# Altium project Cubesat OBC.PrjPcb (part 2 of 2)

## Sheet PC104_52-52.SchDoc
size 420 x 297 mm; SheetNumber: 8; SheetTotal: 13
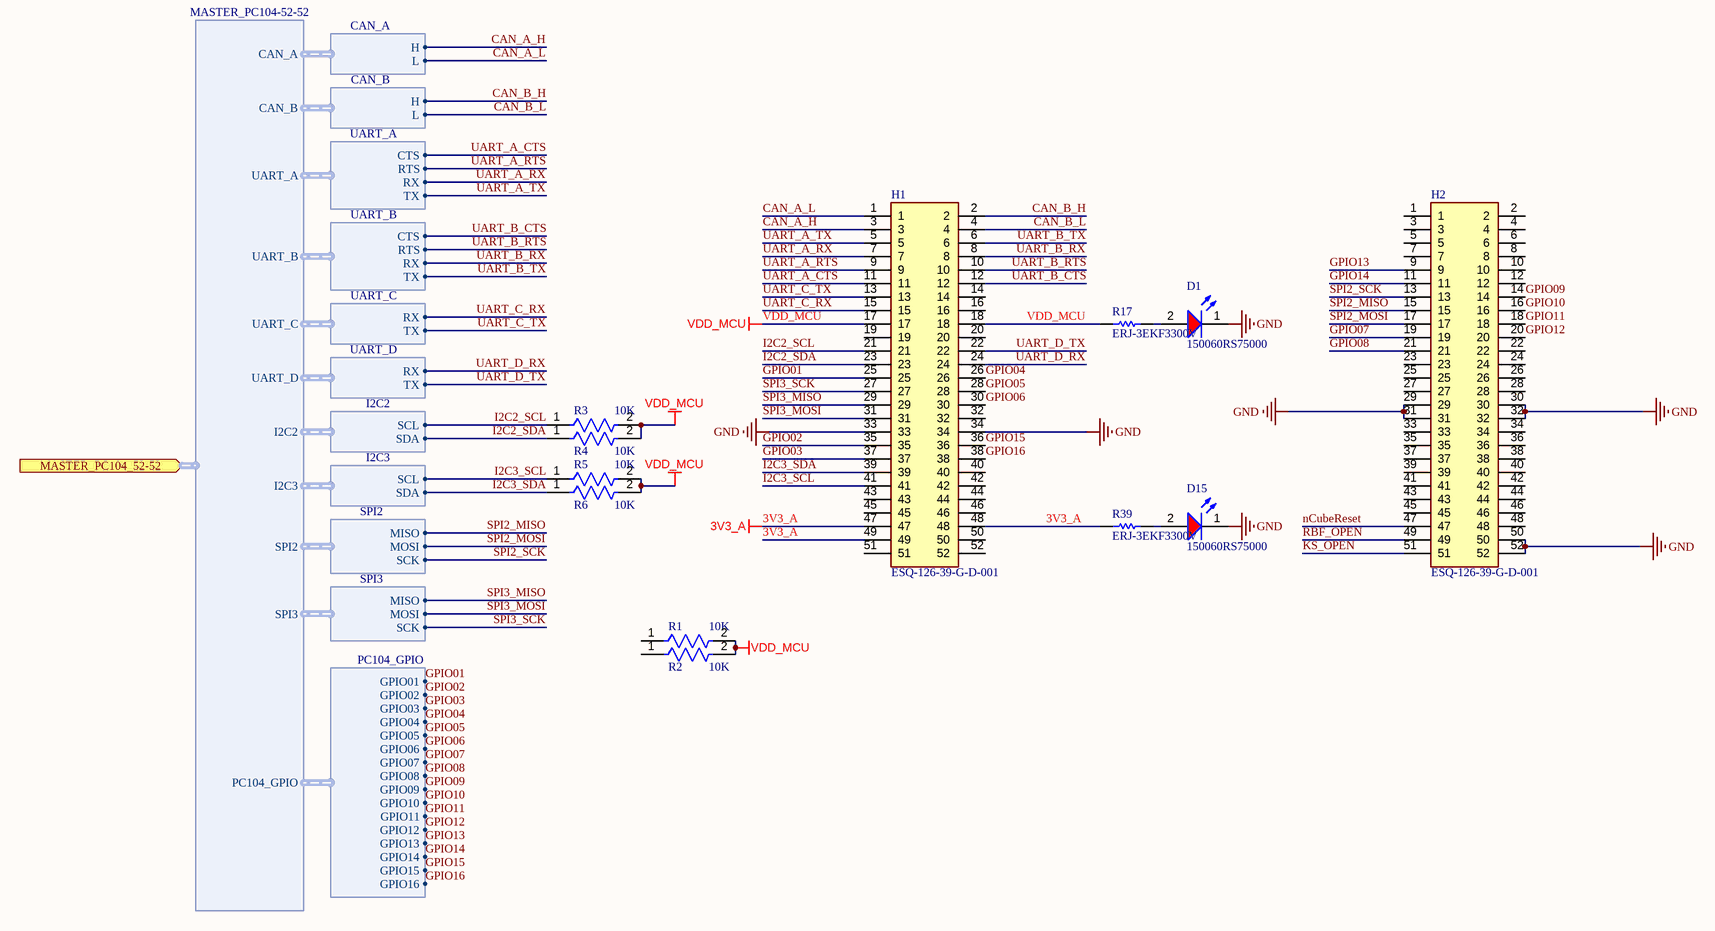
[diagram p10: PC104_52-52.SchDoc]

### Parts
D1  150060RS75000  [WL-SMCW_0603_150060xx75000]
D15  150060RS75000  [WL-SMCW_0603_150060xx75000]
H1  ESQ-126-39-G-D-001  [RHDR52W64P254_2X26_6654X495X1135P]
H2  ESQ-126-39-G-D-001  [RHDR52W64P254_2X26_6654X495X1135P]
R1  10K  [FP-RK73B1J-MFG]
R2  10K  [FP-RK73B1J-MFG]
R3  10K  [FP-RK73B1J-MFG]
R4  10K  [FP-RK73B1J-MFG]
R5  10K  [FP-RK73B1J-MFG]
R6  10K  [FP-RK73B1J-MFG]
R17  ERJ-3EKF3300V  [RESC1608X55X30LL15T15]
R39  ERJ-3EKF3300V  [RESC1608X55X30LL15T15]

### Ports
MASTER_PC104_52-52 (in, harness MASTER_PC104-52-52)

### Harnesses
MASTER_PC104-52-52: CAN_A, CAN_B, UART_A, UART_B, UART_C, UART_D, I2C2, I2C3, SPI3, SPI2, PC104_GPIO
I2C2: SDA, SCL
I2C3: SDA, SCL
UART_C: TX, RX
UART_D: TX, RX
UART_A: TX, RX, RTS, CTS
UART_B: TX, RX, RTS, CTS
CAN_A: L, H
CAN_B: L, H
SPI2: MOSI, MISO, SCK
SPI3: MISO, SCK, MOSI
PC104_GPIO: GPIO01, GPIO02, GPIO03, GPIO04, GPIO05, GPIO06, GPIO07, GPIO08, GPIO09, GPIO10, GPIO11, GPIO12, GPIO13, GPIO14, GPIO15, GPIO16

### Nets
3V3_A: H1.47 H1.48 H1.49 R39.1
GND: D1.1(K) D15.1(K) H1.33 H1.34 H2.29 H2.30 H2.31 H2.32 H2.50 H2.52
VDD_MCU: H1.17 H1.18 R1.2 R2.2 R3.2 R4.2 R5.2 R6.2 R17.1
CAN_A_H: H1.3 ; harness CAN_A.H
CAN_A_L: H1.1 ; harness CAN_A.L
CAN_B_H: H1.2 ; harness CAN_B.H
CAN_B_L: H1.4 ; harness CAN_B.L
GPIO01: H1.25 ; harness PC104_GPIO.GPIO01
GPIO02: H1.35 ; harness PC104_GPIO.GPIO02
GPIO03: H1.37 ; harness PC104_GPIO.GPIO03
GPIO04: H1.26 ; harness PC104_GPIO.GPIO04
GPIO05: H1.28 ; harness PC104_GPIO.GPIO05
GPIO06: H1.30 ; harness PC104_GPIO.GPIO06
GPIO07: H2.19 ; harness PC104_GPIO.GPIO07
GPIO08: H2.21 ; harness PC104_GPIO.GPIO08
GPIO09: H2.14 ; harness PC104_GPIO.GPIO09
GPIO10: H2.16 ; harness PC104_GPIO.GPIO10
GPIO11: H2.18 ; harness PC104_GPIO.GPIO11
GPIO12: H2.20 ; harness PC104_GPIO.GPIO12
GPIO13: H2.9 ; harness PC104_GPIO.GPIO13
GPIO14: H2.11 ; harness PC104_GPIO.GPIO14
GPIO15: H1.36 ; harness PC104_GPIO.GPIO15
GPIO16: H1.38 ; harness PC104_GPIO.GPIO16
I2C2_SCL: H1.21 R3.1 ; harness I2C2.SCL
I2C2_SDA: H1.23 R4.1 ; harness I2C2.SDA
I2C3_SCL: H1.41 R5.1 ; harness I2C3.SCL
I2C3_SDA: H1.39 R6.1 ; harness I2C3.SDA
KS_OPEN: H2.51
nCubeReset: H2.47
RBF_OPEN: H2.49
SPI2_MISO: H2.15 ; harness SPI2.MISO
SPI2_MOSI: H2.17 ; harness SPI2.MOSI
SPI2_SCK: H2.13 ; harness SPI2.SCK
SPI3_MISO: H1.29 ; harness SPI3.MISO
SPI3_MOSI: H1.31 ; harness SPI3.MOSI
SPI3_SCK: H1.27 ; harness SPI3.SCK
UART_A_CTS: H1.11 ; harness UART_A.CTS
UART_A_RTS: H1.9 ; harness UART_A.RTS
UART_A_RX: H1.7 ; harness UART_A.RX  [project net A_2_OBC]
UART_A_TX: H1.5 ; harness UART_A.TX  [project net OBC_2_A]
UART_B_CTS: H1.12 ; harness UART_B.CTS
UART_B_RTS: H1.10 ; harness UART_B.RTS
UART_B_RX: H1.8 ; harness UART_B.RX  [project net B_2_OBC]
UART_B_TX: H1.6 ; harness UART_B.TX  [project net OBC_2_B]
UART_C_RX: H1.15 ; harness UART_C.RX  [project net ESP_2_OBC]
UART_C_TX: H1.13 ; harness UART_C.TX  [project net OBC_2_EPS]
UART_D_RX: H1.24 ; harness UART_D.RX  [project net SR_2_OBC]
UART_D_TX: H1.22 ; harness UART_D.TX  [project net OBC_2_SR]
NetD1_2: D1.2(A) R17.2
NetD15_2: D15.2(A) R39.2

Not connected (* = marked no-connect by the designer): H1 14 16 19 20 32 40 42 43 44 45 46 50 51 52; H2 1 2 3 4 5 6 7 8 10 12 22 23 24 25 26 27 28 33 34 35 36 37 38 39 40 41 42 43 44 45 46 48; R1 1; R2 1

### Notes on the sheet
- THIS DOCUMENT AND THE DATA DISCLOSED HEREIN OR
- HEREWITH IS THE PROPERTY OF ALTIUM LIMITED AND MAY
- DWG NO:
- REVISION
- REV:
- DESCRIPTION
- DATE
- APPROVED
- BE FREELY DISTRIBUTED IN WHOLE. NO RIGHTS ARE
- RESERVED OR EXPRESS OR IMPLIED WARANTEE GIVEN.
- ENG:
- APPROVALS
- PROJECT
- DSN:
- CHK:
- REFERENCE DOCUMENTS
- PROJECT REVISION:
- TITLE
- DOCUMENT REVISION:
- DESIGN ITEM:
- BOM:
- FAB DWG:
- PCB DWG:
- ASSY DWG:
- SCALE:
- A3
- SIZE
- CAGE CODE
- FILE NAME
- DWG NO.
- SHEET
- OF
- REV

### Library data of the parts
D1 D15 = CMP-1426-00001-4: LED Low-Power Uni-Color Red 630nm 2V 2-Pin Chip 0603(1608Metric) T/R; Max Junction Temperature (Tj): 95°C; Dominant Wavelength: 625nm; Lens Style: Clear, Rectangular; Viewing Angle: 140°; Forward Current: 100mA; Max Reverse Voltage (DC): 5V; Luminous Intensity: 250mcd; Test Current: 20mA; Power Dissipation: 72mW; Max Operating Temperature: 85°C; Mount: Surface Mount; Height: 700µm; Packaging: Tape and Reel; REACH SVHC: Unknown; Case Code (Metric): 1608; Peak Wavelength: 630nm; Forward Voltage: 2V; Case/Package: 0603; Color: Red; RoHS: Compliant; Width: 800µm; Reverse Voltage: 5V; Min Operating Temperature: -40°C; Wavelength: 625nm; Case Code (Imperial): 0603; Length: 1.6mm
H1 H2 = CMP-002-00086-1: PC / 104 Connectors Elevated Socket Strip; Manufacturer_Name: SAMTEC; Design Item ID: ESQ-126-39-G-D-001; Mouser Price/Stock: https://www.mouser.co.uk/ProductDetail/Samtec/ESQ-126-39-G-D-001?qs=PB6%2FjmICvI2K%2FCIgL4SVbg%3D%3D; Mouser Part Number: 200-ESQ12639GD001; Source: SamacSys.SchLib; Arrow Price/Stock: https://www.arrow.com/en/products/esq-126-39-g-d-001/samtec?region=nac; Arrow Part Number: ESQ-126-39-G-D-001; Manufacturer_Part_Number: ESQ-126-39-G-D-001; Datasheet Link: http://suddendocs.samtec.com/catalog_english/esq_th.pdf; Height: 11.35mm
R1-R6 = CMP-2000-01851-2: RES 10K OHM 5% 1/10W 0603; Temperature Coefficient: 200ppm/°C; Voltage Rating: 50V; Power Rating: 100mW; Resistance: 10kR; Length: 1.6mm; Lead Free: Lead Free; Resistance Tolerance: 5%; Case Code (Metric): 1608; Width: 0.8mm; Height: 0.45mm; Max Operating Temperature: 155°C; RoHS Compliant: Yes; Resistor Type: Thick Film; Min Operating Temperature: -55°C; Case Code (Imperial): 0603; Technology: THICK FILM; Package Quantity: 5000; Tolerance: 5%; Case/Package: 0603; Voltage Rating (DC): 50V; Depth: 0.8mm; Packaging: Tape and Reel; Number of Pins: 2; Construction: Rectangular; Series: RK73B; Military Standard: Not; Termination: SMD/SMT
R17 R39 = CMP-2000-00435-2: Chip Resistor, 330 Ohm, +/- 1%, 0.1 W, -55 to 155 degC, 0603 (1608 Metric), RoHS, Tape and Reel; Gender: Male; Mating Cycles: 10000; Current Rating: 500 mA; Voltage Rating: 10 V; REACH SVHC: No SVHC; PackageDescription: 2-Pin Surface Mount Device, Body 1.6 x 0.85 mm; Contact Finish: Gold; Pins: 8; ComponentLink1Description: Manufacturer URL; Packaging: Tape and Reel; Max Operating Temperature: 85 degC; Contact Material: Copper; Height: 1.45 mm; Width: 1.45 mm; DatasheetVersion: Apr-15; Package Quantity: 1500; Contact Plating: Gold; PackageReference: 0603; Mount: Surface Mount; Lead Pitch: 1.1 mm; Min Operating Temperature: -25 degC; ComponentLink1URL: http://www.panasonic.com/; ComponentLink2URL: http://industrial.panasonic.com/cdbs/www-data/pdf/RDA0000/AOA0000C86.pdf; Length: 13.7 mm; ComponentLink2Description: Datasheet; RoHSCompliant: true

## Sheet NOR_FLASH.SchDoc
size 420 x 297 mm; SheetNumber: 10; SheetTotal: 13
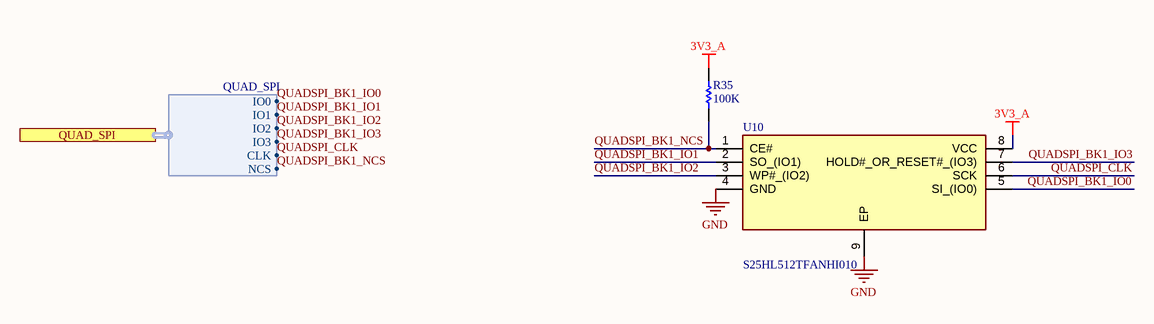
[diagram p11: NOR_FLASH.SchDoc]

### Parts
R35  100K  [RESC1608X55X30ML20T10]
U10  S25HL512TFANHI010  [SON127P800X600X80-9N-D]

### Ports
QUAD_SPI (harness QUAD_SPI)

### Harnesses
QUAD_SPI: IO0, IO1, CLK, NCS, IO2, IO3

### Nets
3V3_A: R35.2 U10.8(VCC)
GND: U10.4(GND) U10.9(EP)
QUADSPI_BK1_IO0: U10.5(SI_(IO0)) ; port QUAD_SPI.IO0
QUADSPI_BK1_IO1: U10.2(SO_(IO1)) ; port QUAD_SPI.IO1
QUADSPI_BK1_IO2: U10.3(WP#_(IO2)) ; port QUAD_SPI.IO2
QUADSPI_BK1_IO3: U10.7(HOLD#_OR_RESET#_(IO3)) ; port QUAD_SPI.IO3
QUADSPI_BK1_NCS: R35.1 U10.1(CE#) ; port QUAD_SPI.NCS
QUADSPI_CLK: U10.6(SCK) ; port QUAD_SPI.CLK

### Notes on the sheet
- THIS DOCUMENT AND THE DATA DISCLOSED HEREIN OR
- HEREWITH IS THE PROPERTY OF ALTIUM LIMITED AND MAY
- DWG NO:
- REVISION
- REV:
- DESCRIPTION
- DATE
- APPROVED
- BE FREELY DISTRIBUTED IN WHOLE. NO RIGHTS ARE
- RESERVED OR EXPRESS OR IMPLIED WARANTEE GIVEN.
- ENG:
- APPROVALS
- PROJECT
- DSN:
- CHK:
- REFERENCE DOCUMENTS
- PROJECT REVISION:
- TITLE
- DOCUMENT REVISION:
- DESIGN ITEM:
- BOM:
- FAB DWG:
- PCB DWG:
- ASSY DWG:
- SCALE:
- A3
- SIZE
- CAGE CODE
- FILE NAME
- DWG NO.
- SHEET
- OF
- REV

### Library data of the parts
R35 = CMP-2000-01852-1: Part Number: RK73B1JTTD104J; Manufacturer: KOA Speer
U10 = S25HL512TFANHI010: Integrated Circuit; Manufacturer_Name: Infineon; Datasheet Link: https://datasheet.datasheetarchive.com/originals/distributors/Datasheets_SAMA/73f7ac27cabd57f4f78d8f5aeecdde91.pdf; Height: 0.8mm; Manufacturer_Part_Number: S25HL512TFANHI010; Mouser Part Number: 727-S25HL512TFANHI01; Mouser Price/Stock: https://www.mouser.co.uk/ProductDetail/Infineon-Technologies/S25HL512TFANHI010?qs=BJlw7L4Cy7%252B6M3sHZp0BRA%3D%3D

## Sheet Ports.SchDoc
size 420 x 297 mm; SheetNumber: 13; SheetTotal: 13
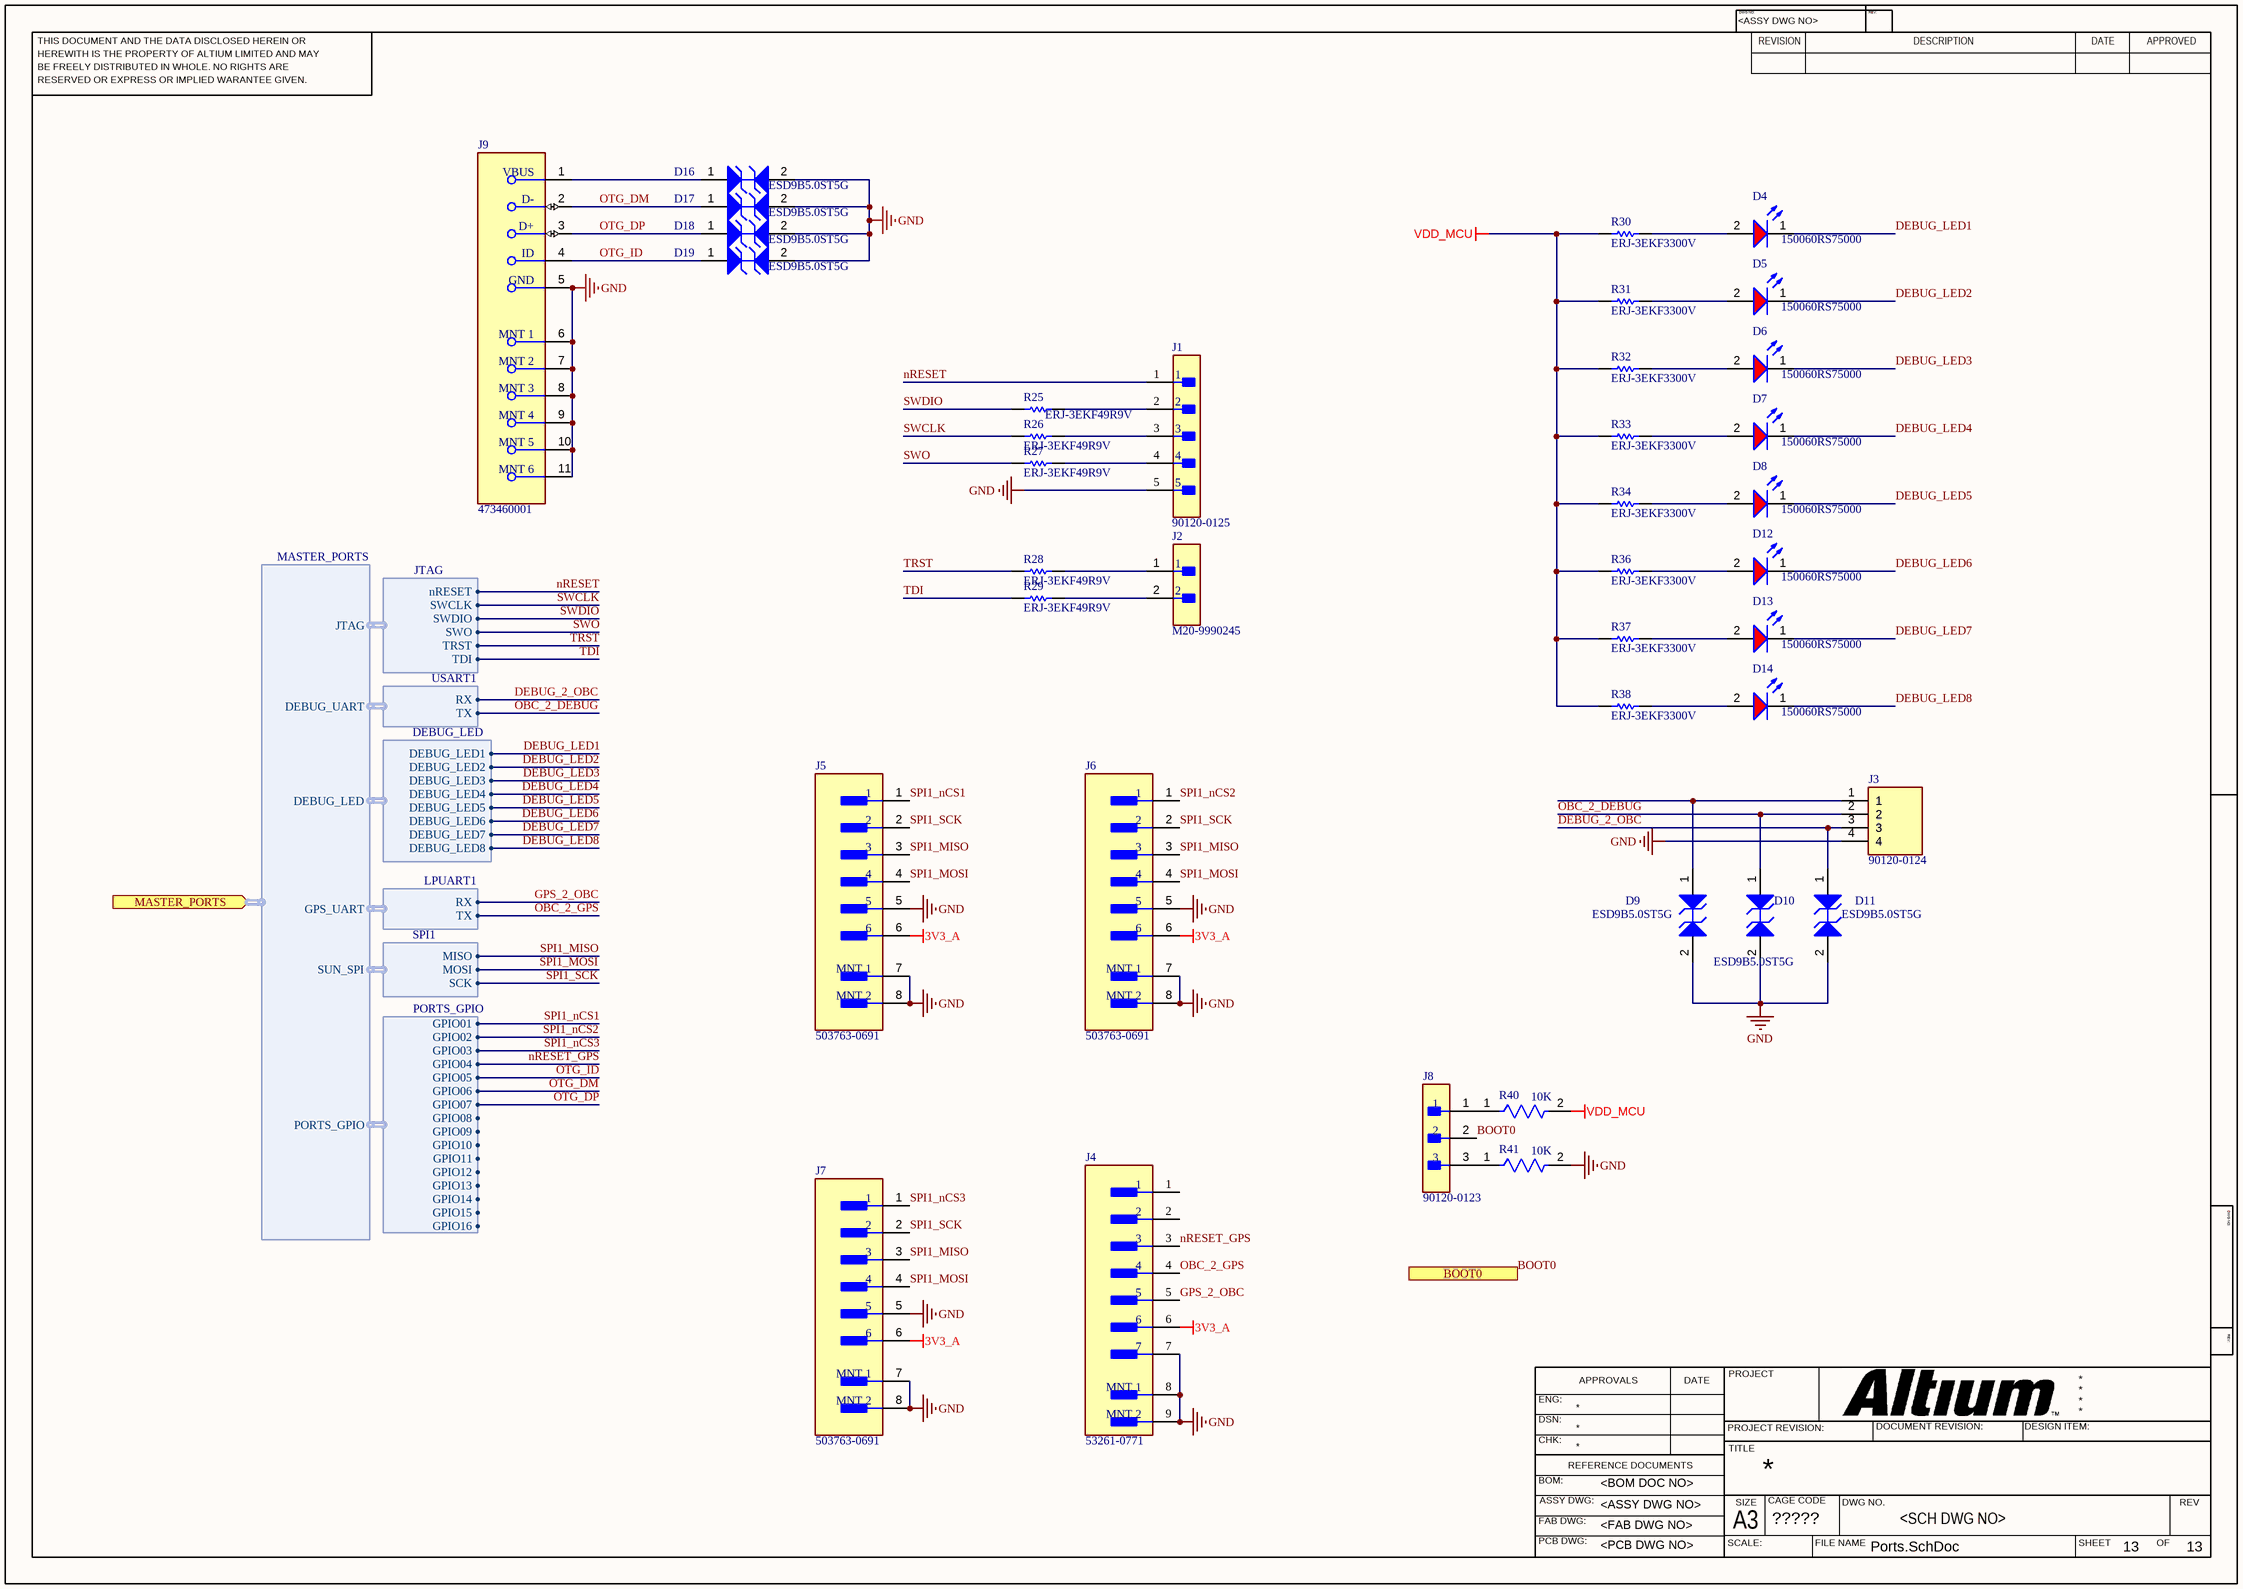
[diagram p12: Ports.SchDoc]

### Parts
D4  150060RS75000  [WL-SMCW_0603_150060xx75000]
D5  150060RS75000  [WL-SMCW_0603_150060xx75000]
D6  150060RS75000  [WL-SMCW_0603_150060xx75000]
D7  150060RS75000  [WL-SMCW_0603_150060xx75000]
D8  150060RS75000  [WL-SMCW_0603_150060xx75000]
D9  ESD9B5.0ST5G  [ONSC-SOD-923-2-514AB-01_V]
D10  ESD9B5.0ST5G  [ONSC-SOD-923-2-514AB-01_V]
D11  ESD9B5.0ST5G  [ONSC-SOD-923-2-514AB-01_V]
D12  150060RS75000  [WL-SMCW_0603_150060xx75000]
D13  150060RS75000  [WL-SMCW_0603_150060xx75000]
D14  150060RS75000  [WL-SMCW_0603_150060xx75000]
D16  ESD9B5.0ST5G  [ONSC-SOD-923-2-514AB-01_V]
D17  ESD9B5.0ST5G  [ONSC-SOD-923-2-514AB-01_V]
D18  ESD9B5.0ST5G  [ONSC-SOD-923-2-514AB-01_V]
D19  ESD9B5.0ST5G  [ONSC-SOD-923-2-514AB-01_V]
J1  90120-0125  [FP-90120-0125-MFG]
J2  M20-9990245  [FP-M20-9990245-MFG]
J3  90120-0124  [HDRV4W65P0X254_1X4_1016X254X945P]
J4  53261-0771  [FP-53261-0771-MFG]
J5  503763-0691  [FP-503763-0691-MFG]
J6  503763-0691  [FP-503763-0691-MFG]
J7  503763-0691  [FP-503763-0691-MFG]
J8  90120-0123  [FP-90120-0123-MFG]
J9  473460001  [FP-473460001-MFG]
R25  ERJ-3EKF49R9V  [RESC1608X55X30ML15T15]
R26  ERJ-3EKF49R9V  [RESC1608X55X30ML15T15]
R27  ERJ-3EKF49R9V  [RESC1608X55X30ML15T15]
R28  ERJ-3EKF49R9V  [RESC1608X55X30ML15T15]
R29  ERJ-3EKF49R9V  [RESC1608X55X30ML15T15]
R30  ERJ-3EKF3300V  [RESC1608X55X30LL15T15]
R31  ERJ-3EKF3300V  [RESC1608X55X30LL15T15]
R32  ERJ-3EKF3300V  [RESC1608X55X30LL15T15]
R33  ERJ-3EKF3300V  [RESC1608X55X30LL15T15]
R34  ERJ-3EKF3300V  [RESC1608X55X30LL15T15]
R36  ERJ-3EKF3300V  [RESC1608X55X30LL15T15]
R37  ERJ-3EKF3300V  [RESC1608X55X30LL15T15]
R38  ERJ-3EKF3300V  [RESC1608X55X30LL15T15]
R40  10K  [FP-RK73B1J-MFG]
R41  10K  [FP-RK73B1J-MFG]

### Ports
BOOT0 (in), MASTER_PORTS (in, harness MASTER_PORTS)

### Harnesses
MASTER_PORTS: JTAG, DEBUG_UART, DEBUG_LED, GPS_UART, SUN_SPI, PORTS_GPIO
JTAG: nRESET, SWCLK, SWDIO, SWO, TDI, TRST
USART1: TX, RX
DEBUG_LED: DEBUG_LED1, DEBUG_LED2, DEBUG_LED3, DEBUG_LED4, DEBUG_LED5, DEBUG_LED6, DEBUG_LED7, DEBUG_LED8
LPUART1: TX, RX
SPI1: MOSI, MISO, SCK
PORTS_GPIO: GPIO01, GPIO02, GPIO03, GPIO04, GPIO05, GPIO06, GPIO07, GPIO08, GPIO09, GPIO10, GPIO11, GPIO12, GPIO13, GPIO14, GPIO15, GPIO16

### Nets
3V3_A: J4.6 J5.6 J6.6 J7.6
GND: D9.2(A2) D10.2(A2) D11.2(A2) D16.2(A2) D17.2(A2) D18.2(A2) D19.2(A2) J1.5 J3.4 J4.7 J4.8(MNT_1) J4.9(MNT_2) J5.5 J5.7(MNT_1) J5.8(MNT_2) J6.5 J6.7(MNT_1) J6.8(MNT_2) J7.5 J7.7(MNT_1) J7.8(MNT_2) J9.5(GND) J9.6(MNT_1) J9.7(MNT_2) J9.8(MNT_3) J9.9(MNT_4) J9.10(MNT_5) J9.11(MNT_6) R41.2
VDD_MCU: R30.1 R31.1 R32.1 R33.1 R34.1 R36.1 R37.1 R38.1 R40.2
BOOT0: J8.2 ; port BOOT0
DEBUG_2_OBC: D11.1(A1) J3.3 ; harness USART1.RX
DEBUG_LED1: D4.1(K) ; harness DEBUG_LED.DEBUG_LED1
DEBUG_LED2: D5.1(K) ; harness DEBUG_LED.DEBUG_LED2
DEBUG_LED3: D6.1(K) ; harness DEBUG_LED.DEBUG_LED3
DEBUG_LED4: D7.1(K) ; harness DEBUG_LED.DEBUG_LED4
DEBUG_LED5: D8.1(K) ; harness DEBUG_LED.DEBUG_LED5
DEBUG_LED6: D12.1(K) ; harness DEBUG_LED.DEBUG_LED6
DEBUG_LED7: D13.1(K) ; harness DEBUG_LED.DEBUG_LED7
DEBUG_LED8: D14.1(K) ; harness DEBUG_LED.DEBUG_LED8
GPS_2_OBC: J4.5 ; harness LPUART1.RX
nRESET: J1.1 ; harness JTAG.nRESET
nRESET_GPS: J4.3 ; harness PORTS_GPIO.GPIO04
OBC_2_DEBUG: D10.1(A1) J3.2 ; harness USART1.TX
OBC_2_GPS: J4.4 ; harness LPUART1.TX
OTG_DM: D17.1(A1) J9.2(D-) ; harness PORTS_GPIO.GPIO06
OTG_DP: D18.1(A1) J9.3(D+) ; harness PORTS_GPIO.GPIO07
OTG_ID: D19.1(A1) J9.4(ID) ; harness PORTS_GPIO.GPIO05
SPI1_MISO: J5.3 J6.3 J7.3 ; harness SPI1.MISO
SPI1_MOSI: J5.4 J6.4 J7.4 ; harness SPI1.MOSI
SPI1_nCS1: J5.1 ; harness PORTS_GPIO.GPIO01
SPI1_nCS2: J6.1 ; harness PORTS_GPIO.GPIO02
SPI1_nCS3: J7.1 ; harness PORTS_GPIO.GPIO03
SPI1_SCK: J5.2 J6.2 J7.2 ; harness SPI1.SCK
SWCLK: R26.1 ; harness JTAG.SWCLK
SWDIO: R25.1 ; harness JTAG.SWDIO
SWO: R27.1 ; harness JTAG.SWO
TDI: R29.1 ; harness JTAG.TDI
TRST: R28.1 ; harness JTAG.TRST
NetD4_2: D4.2(A) R30.2
NetD5_2: D5.2(A) R31.2
NetD6_2: D6.2(A) R32.2
NetD7_2: D7.2(A) R33.2
NetD8_2: D8.2(A) R34.2
NetD9_1: D9.1(A1) J3.1
NetD12_2: D12.2(A) R36.2
NetD13_2: D13.2(A) R37.2
NetD14_2: D14.2(A) R38.2
NetD16_1: D16.1(A1) J9.1(VBUS)
NetJ1_2: J1.2 R25.2
NetJ1_3: J1.3 R26.2
NetJ1_4: J1.4 R27.2
NetJ2_1: J2.1 R28.2
NetJ2_2: J2.2 R29.2
NetJ8_1: J8.1 R40.1
NetJ8_3: J8.3 R41.1

Not connected (* = marked no-connect by the designer): J4 1 2

### Notes on the sheet
- THIS DOCUMENT AND THE DATA DISCLOSED HEREIN OR
- HEREWITH IS THE PROPERTY OF ALTIUM LIMITED AND MAY
- DWG NO:
- REVISION
- REV:
- DESCRIPTION
- DATE
- APPROVED
- BE FREELY DISTRIBUTED IN WHOLE. NO RIGHTS ARE
- RESERVED OR EXPRESS OR IMPLIED WARANTEE GIVEN.
- ENG:
- APPROVALS
- PROJECT
- DSN:
- CHK:
- REFERENCE DOCUMENTS
- PROJECT REVISION:
- TITLE
- DOCUMENT REVISION:
- DESIGN ITEM:
- BOM:
- FAB DWG:
- PCB DWG:
- ASSY DWG:
- SCALE:
- A3
- SIZE
- CAGE CODE
- FILE NAME
- DWG NO.
- SHEET
- OF
- REV

### Library data of the parts
D4-D8 D12-D14 = CMP-1426-00001-4: as D1 on sheet PC104_52-52; Max Operating Temperature: 85°C; Mount: Surface Mount; Height: 700µm; Packaging: Tape and Reel; REACH SVHC: Unknown; Case Code (Metric): 1608; Peak Wavelength: 630nm; Forward Voltage: 2V; Case/Package: 0603; Color: Red; RoHS: Compliant; Width: 800µm; Reverse Voltage: 5V; Min Operating Temperature: -40°C; Wavelength: 625nm; Case Code (Imperial): 0603; Length: 1.6mm
D9-D11 D16-D19 = CMP-1063-00119-1: Transient Voltage Suppressor, Micro-Packaged Diode for ESD Protection, 2-Pin SOD-923, Pb-Free, Tape and Reel; Manufacturer: On Semiconductor; Number of Lines: 1; Direction: Bidirectional; V(BR) Min (V): 5.8; VRWM Max (V): 5; Packing: Tape and Reel; PackageDescription: 2-Pin SOD, Body 0.8 x 0.6 mm; IR Max (uA): 1; ComponentLink3Description: Package Specification; PartNumber: ESD9B5.0ST5G; ComponentLink1URL: http://www.onsemi.com/; RoHS: Pb-Free; Mounting Technology: Surface Mount; DatasheetVersion: Rev. 2; ComponentLink2URL: http://www.onsemi.cn/pub_link/Collateral/ESD9B-D.PDF; ComponentLink3URL: http://www.onsemi.com/pub_link/Collateral/514AB.PDF; PackageReference: SOD-923-2-514AB-01; PackageVersion: Rev. C, 03/2011; ComponentLink1Description: Manufacturer URL; ComponentLink2Description: Datasheet
J1 = CMP-00257-00655425-1: 90120-0125 2.54mm Pitch C-Grid III Header, Single Row, Vertical, 5 Circuits, Tin (Sn) Plating; NexarPartId: 655425; Manufacturer Lifecycle Status: ACTIVE; Lead Length: 2.9mm; Number of Positions: 5; Current Rating: 3A; Mating Post Length: 6.75mm; Glow Wire Compliant: Non-compliant; Contact Resistance: 20mΩ; Voltage Rating: 350V; Gender: Male; Max Voltage Rating (DC): 350.35kV; Max Operating Temperature: 125°C; Number of Pins: 5; Plating: Tin; Contact Material: Brass; Mount: Through Hole; Contact Gender: Male; Packaging: Bulk; Schedule B: 8536694040; Lifecycle Status: Production; Lead Pitch: 2.54mm; Radiation Hardening: No; Orientation: Vertical; Min Operating Temperature: -55°C; Country of Origin: SK; Housing Color: Black; REACH SVHC: No SVHC; Contact Plating: Tin; Number of Rows: 1; Number of Circuits: 5; Termination: Solder; Number of Contacts: 5; Pitch: 2.54mm; Housing Material: Polyester; RoHS: Compliant; Lead Free: Lead Free; Voltage Rating (AC): 350V
J2 = CMP-15831-000105-1: CONN HEADER VERT 2POS 2.54MM; Working Voltage: 750V; Gender: Male; Number of Poles: 2; Current Rating: 3A; Mated Stacking Heights: 16.54mm; Contact Resistance: 25mR; Connector Type: Male Pin; Insulation Resistance: 10GR; Mating Cycles: 300; Voltage: 50V; Flammability Rating: UL94 V-0; Pitch: 2.54mm; Series: M20; Number of Contacts: 2; Height: 0.12inch; Min Operating Temperature: -40°C; Contact Finish - Mating: GOLD; Number of Positions: 2; Number of Rows: 1; Packaging: Bulk; Package Quantity: 1000; Voltage Rating (AC): 750V; Current: 3A; Mount: Through Hole; Case/Package: SIL; Orientation: Straight; Contact Shape: Square; Weight: 0.25lb; Radiation Hardening: No; Fastening Type: Pull; Length: 5.08mm; Depth: 2.54mm; Contact Mating Length: 0.24inch; Housing Material: Nylon; Reach SVHC Compliant: Yes; Insulation Material: Nylon; Color: Black; Width: 0.25inch; Insulation Color: Black; Contact Material: Brass; Contact Type: Male Pin; Termination: Solder; Max Operating Temperature: 105°C; Contact Plating: Gold; Housing Color: Black; Max Current Rating: 3A; Lead Pitch: 2.54mm
J3 = 90120-0124: Connector; Manufacturer_Name: Molex; Datasheet Link: https://componentsearchengine.com/Datasheets/2/90120-0124.pdf; Height: 9.45mm; Manufacturer_Part_Number: 90120-0124; Mouser Part Number: 538-90120-0124; Mouser Price/Stock: https://www.mouser.co.uk/ProductDetail/Molex/90120-0124?qs=PvP5v7EimsmprSEogp1JLQ%3D%3D
J4 = CMP-04776-000278-1: CONN HEADER SMD R/A 7POS 1.25MM; Voltage Rating (AC): 125V; Number of Contacts: 7; Connector Type: Blade Pin; Body Plating: Tin; Insulation Resistance: 100MR; Current Rating: 1A; Contact Resistance: 20mR; Min Operating Temperature: -40°C; Contact Gender: Male; Contact Material: Bronze; Number of Positions: 7; Radiation Hardening: No; Packaging: Tape and Reel; Pitch: 1.25mm; Flammability Rating: UL94 V-0; Orientation: Right Angle; Color: Natural; Number of Rows: 1; Series: PicoBlade; Length: 13.9mm; Lead Pitch: 1.25mm; Contact Type: Blade Pin; Mount: Surface Mount; Depth: 5.2mm; Housing Material: Nylon; Contact Plating: Tin; Working Voltage: 125V; Max Operating Temperature: 85°C; Voltage Rating: 125V; RoHS Compliant: Yes; Housing Color: Natural; Termination: Solder
J5-J7 = CMP-04776-000530-1: CONN HEADER SMD R/A 6POS 1MM
J8 = CMP-04776-000237-1: CONN HEADER VERT 3POS 2.54MM; Number of Circuits: 3; Max Voltage Rating (DC): 350.35kV; Contact Resistance: 20mR; Gender: Male; Voltage Rating (AC): 350V; Glow Wire Compliant: Non-compliant; Current Rating: 3A; Contact Post Length: 2.9mm; Number of Contacts: 3; Number of Rows: 1; Max Operating Temperature: 125°C; Orientation: Vertical; Number of Positions: 3; Packaging: Tray; Contact Mating Length: 6.75mm; Housing Color: Black; Termination: Solder; Contact Material: Brass; Radiation Hardening: No; Lead Free: Lead Free; Pitch: 2.54mm; RoHS Compliant: Yes; Voltage Rating: 350V; Contact Plating: Tin; Color: Black; Min Operating Temperature: -55°C; Mount: Through Hole; Housing Material: Polyester; Series: 90120; Contact Gender: Male; REACH SVHC: No SVHC
J9 = CMP-2000-05246-2: CONN RCPT USB2.0 MICRO B SMD R/A; Manufacturer: Molex; Conn Orientation: Right Angle; Is Female: yes; Shielding: true; Pitch: 0.65mm; Number Of Contacts: 5; Voltage Rating: 30V; Current Rating: 1.8A; Device Class L2: USB Connectors; Digikey Description: CONN RCPT USB2.0 MICRO B SMD R/A; Height: 2.945mm; RoHS: TRUE; ComponentLink2Description: Datasheet; Octopart: https://octopart.com/47346-0001-molex-7164928; Automotive: No; Package: 0; Category: Conn; Device Class L1: Connectors; Usb Standard: USB 2.0; Temperature: -30°C to +85°C; Temperature Range Low: -30°C; Footprint Url: https://www.molex.com/pdm_docs/sd/473460001_sd.pdf; ComponentLink2URL: https://www.molex.com/webdocs/datasheets/pdf/en-us/0473460001_IO_CONNECTORS.pdf; Lead Free: Yes; Manufacturer Part Number: 473460001; Contact Material: Gold,Nickel; Temperature Range High: +85°C; Device Class L3: unset
R25-R29 = CMP-2000-00538-1: Manufacturer: Panasonic; Part Number: ERJ-3EKF49R9V
R30-R34 R36-R38 = CMP-2000-00435-2: as R17 on sheet PC104_52-52; REACH SVHC: No SVHC; PackageDescription: 2-Pin Surface Mount Device, Body 1.6 x 0.85 mm; Contact Finish: Gold; Pins: 8; ComponentLink1Description: Manufacturer URL; Packaging: Tape and Reel; Max Operating Temperature: 85 degC; Contact Material: Copper; Height: 1.45 mm; Width: 1.45 mm; DatasheetVersion: Apr-15; Package Quantity: 1500; Contact Plating: Gold; PackageReference: 0603; Mount: Surface Mount; Lead Pitch: 1.1 mm; Min Operating Temperature: -25 degC; ComponentLink1URL: http://www.panasonic.com/; ComponentLink2URL: http://industrial.panasonic.com/cdbs/www-data/pdf/RDA0000/AOA0000C86.pdf; Length: 13.7 mm; ComponentLink2Description: Datasheet; RoHSCompliant: true
R40 R41 = CMP-2000-01851-2: as R1 on sheet PC104_52-52; Length: 1.6mm; Lead Free: Lead Free; Resistance Tolerance: 5%; Case Code (Metric): 1608; Width: 0.8mm; Height: 0.45mm; Max Operating Temperature: 155°C; RoHS Compliant: Yes; Resistor Type: Thick Film; Min Operating Temperature: -55°C; Case Code (Imperial): 0603; Technology: THICK FILM; Package Quantity: 5000; Tolerance: 5%; Case/Package: 0603; Voltage Rating (DC): 50V; Depth: 0.8mm; Packaging: Tape and Reel; Number of Pins: 2; Construction: Rectangular; Series: RK73B; Military Standard: Not; Termination: SMD/SMT

## Nets that join several sheets
3V3_A: CAN1 (C28.1 U8.3), CAN2 (C30.1 U9.3), M1 (6 pins), MAG_MMC5983MA (5 pins), IMU_ISM330ISN (6 pins), M2 (6 pins), PC104_52-52 (H1.47 H1.48 H1.49 R39.1), NOR_FLASH (R35.2 U10.8), Ports (J4.6 J5.6 J6.6 J7.6)
GND: MCU (U11.2 U12.2 U13.2), Crystals (6 pins), MCU_Power (30 pins), Watchdog (C18.2 R14.1 U1.2), CAN1 (C28.2 C29.2 D2.3 U8.2), CAN2 (C30.2 C31.2 D3.3 U9.2), M1 (C27_M1.2 U6_M1.4 U6_M1.9 U7_M1.3), MAG_MMC5983MA (5 pins), IMU_ISM330ISN (7 pins), M2 (C27_M2.2 U6_M2.4 U6_M2.9 U7_M2.3), PC104_52-52 (10 pins), NOR_FLASH (U10.4 U10.9), Ports (29 pins)
VDD_MCU: MCU (U11.5 U12.5 U13.5), MCU_Power (32 pins), Watchdog (5 pins), PC104_52-52 (9 pins), Ports (9 pins)
A_2_OBC: MCU (U11.1), PC104_52-52 (H1.7)
B_2_OBC: MCU (U11.3), PC104_52-52 (H1.8)
BOOT0: MCU (U0.138), Ports (J8.2)
CAN1_RX: MCU (U0.114), CAN1 (U8.1)
CAN1_TX: MCU (U0.115), CAN1 (U8.4)
CAN2_RX: MCU (U0.73), CAN2 (U9.1)
CAN2_TX: MCU (U0.74), CAN2 (U9.4)
CAN_A_H: CAN1 (D2.2 R21.1 U8.7), PC104_52-52 (H1.3)
CAN_A_L: CAN1 (D2.1 R22.2 U8.6), PC104_52-52 (H1.1)
CAN_B_H: CAN2 (D3.2 R23.1 U9.7), PC104_52-52 (H1.2)
CAN_B_L: CAN2 (D3.1 R24.2 U9.6), PC104_52-52 (H1.4)
DEBUG_2_OBC: MCU (U13.1), Ports (D11.1 J3.3)
DEBUG_LED1: MCU (U0.123), Ports (D4.1)
DEBUG_LED2: MCU (U0.127), Ports (D5.1)
DEBUG_LED3: MCU (U0.132), Ports (D6.1)
DEBUG_LED4: MCU (U0.135), Ports (D7.1)
DEBUG_LED5: MCU (U0.136), Ports (D8.1)
DEBUG_LED6: MCU (U0.139), Ports (D12.1)
DEBUG_LED7: MCU (U0.140), Ports (D13.1)
DEBUG_LED8: MCU (U0.141), Ports (D14.1)
DONE: MCU (U0.15), Watchdog (U1.4)
DRDY_MMC5983MA: MCU (U0.77), MAG_MMC5983MA (U4.15)
ESP_2_OBC: MCU (U12.3), PC104_52-52 (H1.15)
GPIO01: MCU (U0.86), PC104_52-52 (H1.25)
GPIO02: MCU (U0.60), PC104_52-52 (H1.35)
GPIO03: MCU (U0.58), PC104_52-52 (H1.37)
GPIO04: MCU (U0.82), PC104_52-52 (H1.26)
GPIO05: MCU (U0.81), PC104_52-52 (H1.28)
GPIO06: MCU (U0.79), PC104_52-52 (H1.30)
GPIO07: MCU (U0.89), PC104_52-52 (H2.19)
GPIO08: MCU (U0.87), PC104_52-52 (H2.21)
GPIO09: MCU (U0.97), PC104_52-52 (H2.14)
GPIO10: MCU (U0.91), PC104_52-52 (H2.16)
GPIO11: MCU (U0.90), PC104_52-52 (H2.18)
GPIO12: MCU (U0.88), PC104_52-52 (H2.20)
GPIO13: MCU (U0.100), PC104_52-52 (H2.9)
GPIO14: MCU (U0.98), PC104_52-52 (H2.11)
GPIO15: MCU (U0.59), PC104_52-52 (H1.36)
GPIO16: MCU (U0.57), PC104_52-52 (H1.38)
GPS_2_OBC: MCU (U13.3), Ports (J4.5)
I2C2_SCL: MCU (U0.11), PC104_52-52 (H1.21 R3.1)
I2C2_SDA: MCU (U0.10), PC104_52-52 (H1.23 R4.1)
I2C3_SCL: MCU (U0.92), PC104_52-52 (H1.41 R5.1)
I2C3_SDA: MCU (U0.99), PC104_52-52 (H1.39 R6.1)
INT1_ISM330ISN: MCU (U0.48), IMU_ISM330ISN (U2.4)
INT2_ISM330ISN: MCU (U0.49), IMU_ISM330ISN (U2.9)
nCS_ISM330ISN: MCU (U0.46), IMU_ISM330ISN (R15.1 U2.12 U3.1)
nCS_MMC5983MA: MCU (U0.78), MAG_MMC5983MA (R16.1 U4.4 U5.1)
nCS_MRAM: MCU (U0.96), M1 (R20_M1.1 U6_M1.1 U7_M1.1)
nCS_MRAM: MCU (U0.85), M2 (R20_M2.1 U6_M2.1 U7_M2.1)
nRESET: MCU_Power (U0.25), Watchdog (R13.2 U1.6), Ports (J1.1)
nRESET_GPS: MCU (U0.50), Ports (J4.3)
OBC_2_A: MCU (R7.1), PC104_52-52 (H1.5)
OBC_2_B: MCU (R8.1), PC104_52-52 (H1.6)
OBC_2_DEBUG: MCU (R11.1), Ports (D10.1 J3.2)
OBC_2_EPS: MCU (R9.1), PC104_52-52 (H1.13)
OBC_2_GPS: MCU (R12.1), Ports (J4.4)
OBC_2_SR: MCU (R10.1), PC104_52-52 (H1.22)
OTG_DM: MCU (U0.103), Ports (D17.1 J9.2)
OTG_DP: MCU (U0.104), Ports (D18.1 J9.3)
OTG_ID: MCU (U0.102), Ports (D19.1 J9.4)
PC14: MCU (U0.8), Crystals (C19.1 Y1.1)
PC15: MCU (U0.9), Crystals (C20.1 Y1.2)
PH0: MCU (U0.23), Crystals (C21.1 Y2.1)
PH1: MCU (U0.24), Crystals (C22.1 Y2.3)
QUADSPI_BK1_IO0: MCU (U0.20), NOR_FLASH (U10.5)
QUADSPI_BK1_IO1: MCU (U0.21), NOR_FLASH (U10.2)
QUADSPI_BK1_IO2: MCU (U0.19), NOR_FLASH (U10.3)
QUADSPI_BK1_IO3: MCU (U0.18), NOR_FLASH (U10.7)
QUADSPI_BK1_NCS: MCU (U0.64), NOR_FLASH (R35.1 U10.1)
QUADSPI_CLK: MCU (U0.22), NOR_FLASH (U10.6)
SPI1_MISO: MCU (U0.67), MAG_MMC5983MA (U5.4), IMU_ISM330ISN (U3.4), Ports (J5.3 J6.3 J7.3)
SPI1_MOSI: MCU (U0.68), MAG_MMC5983MA (U4.16), IMU_ISM330ISN (U2.14), Ports (J5.4 J6.4 J7.4)
SPI1_nCS1: MCU (U0.13), Ports (J5.1)
SPI1_nCS2: MCU (U0.2), Ports (J6.1)
SPI1_nCS3: MCU (U0.1), Ports (J7.1)
SPI1_SCK: MCU (U0.66), MAG_MMC5983MA (U4.1), IMU_ISM330ISN (U2.13), Ports (J5.2 J6.2 J7.2)
SPI2_MISO: MCU (U0.75), M1 (U7_M1.4), M2 (U7_M2.4), PC104_52-52 (H2.15)
SPI2_MOSI: MCU (U0.76), M1 (U6_M1.5), M2 (U6_M2.5), PC104_52-52 (H2.17)
SPI2_SCK: MCU (U0.69), M1 (U6_M1.6), M2 (U6_M2.6), PC104_52-52 (H2.13)
SPI3_MISO: MCU (U0.125), PC104_52-52 (H1.29)
SPI3_MOSI: MCU (U0.126), PC104_52-52 (H1.31)
SPI3_SCK: MCU (U0.124), PC104_52-52 (H1.27)
SR_2_OBC: MCU (U12.1), PC104_52-52 (H1.24)
SWCLK: MCU (U0.109), Ports (R26.1)
SWDIO: MCU (U0.110), Ports (R25.1)
SWO: MCU (U0.133), Ports (R27.1)
TDI: MCU (U0.105), Ports (R29.1)
TRST: MCU (U0.134), Ports (R28.1)
UART_A_CTS: MCU (U0.117), PC104_52-52 (H1.11)
UART_A_RTS: MCU (U0.118), PC104_52-52 (H1.9)
UART_B_CTS: MCU (U0.80), PC104_52-52 (H1.12)
UART_B_RTS: MCU (U0.47), PC104_52-52 (H1.10)
WAKE: MCU (U0.14), Watchdog (U1.5)